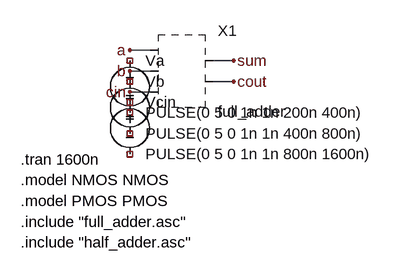
[diagram p0: schematic full_adder_test.asc]
full_adder_test.asc, the LTspice schematic file:
Version 4.1
SHEET 1 880 680

WIRE 176 128 144 128
WIRE 176 160 144 160
WIRE 176 192 144 192
WIRE 304 144 272 144
WIRE 304 176 272 176

FLAG 304 144 sum
FLAG 304 176 cout
FLAG 144 128 a
FLAG 144 160 b
FLAG 144 192 cin

SYMBOL full_adder 224 144 R0
SYMATTR InstName X1

SYMBOL voltage 144 128 R0
WINDOW 123 0 0 Left 0
WINDOW 39 0 0 Left 0
SYMATTR InstName Va
SYMATTR Value PULSE(0 5 0 1n 1n 200n 400n)

SYMBOL voltage 144 160 R0
WINDOW 123 0 0 Left 0
WINDOW 39 0 0 Left 0
SYMATTR InstName Vb
SYMATTR Value PULSE(0 5 0 1n 1n 400n 800n)

SYMBOL voltage 144 192 R0
WINDOW 123 0 0 Left 0
WINDOW 39 0 0 Left 0
SYMATTR InstName Vcin
SYMATTR Value PULSE(0 5 0 1n 1n 800n 1600n)

TEXT -24 296 Left 2 !.tran 1600n
TEXT -24 328 Left 2 !.model NMOS NMOS
TEXT -24 360 Left 2 !.model PMOS PMOS
TEXT -24 392 Left 2 !.include "full_adder.asc"
TEXT -24 424 Left 2 !.include "half_adder.asc"

The netlist it stands for:
* full_adder_test.asc
* X1: full_adder (symbol full_adder not available, pin order unknown); nets seen at it: a, b, cin, cout, sum
Va NC_01 NC_02 PULSE(0 5 0 1n 1n 200n 400n)
Vb NC_03 NC_04 PULSE(0 5 0 1n 1n 400n 800n)
Vcin NC_05 NC_06 PULSE(0 5 0 1n 1n 800n 1600n)
.tran 1600n
.model NMOS NMOS
.model PMOS PMOS
.include "full_adder.asc"
.include "half_adder.asc"
.backanno
.end